# EasyEDA schematic SCH_Endstop_durable.json
TITLE: Sheet_1; REV: 1.0; Date: 2024-06-12; Sheet: 1/1; Drawn By: matias1; Company: Your Company
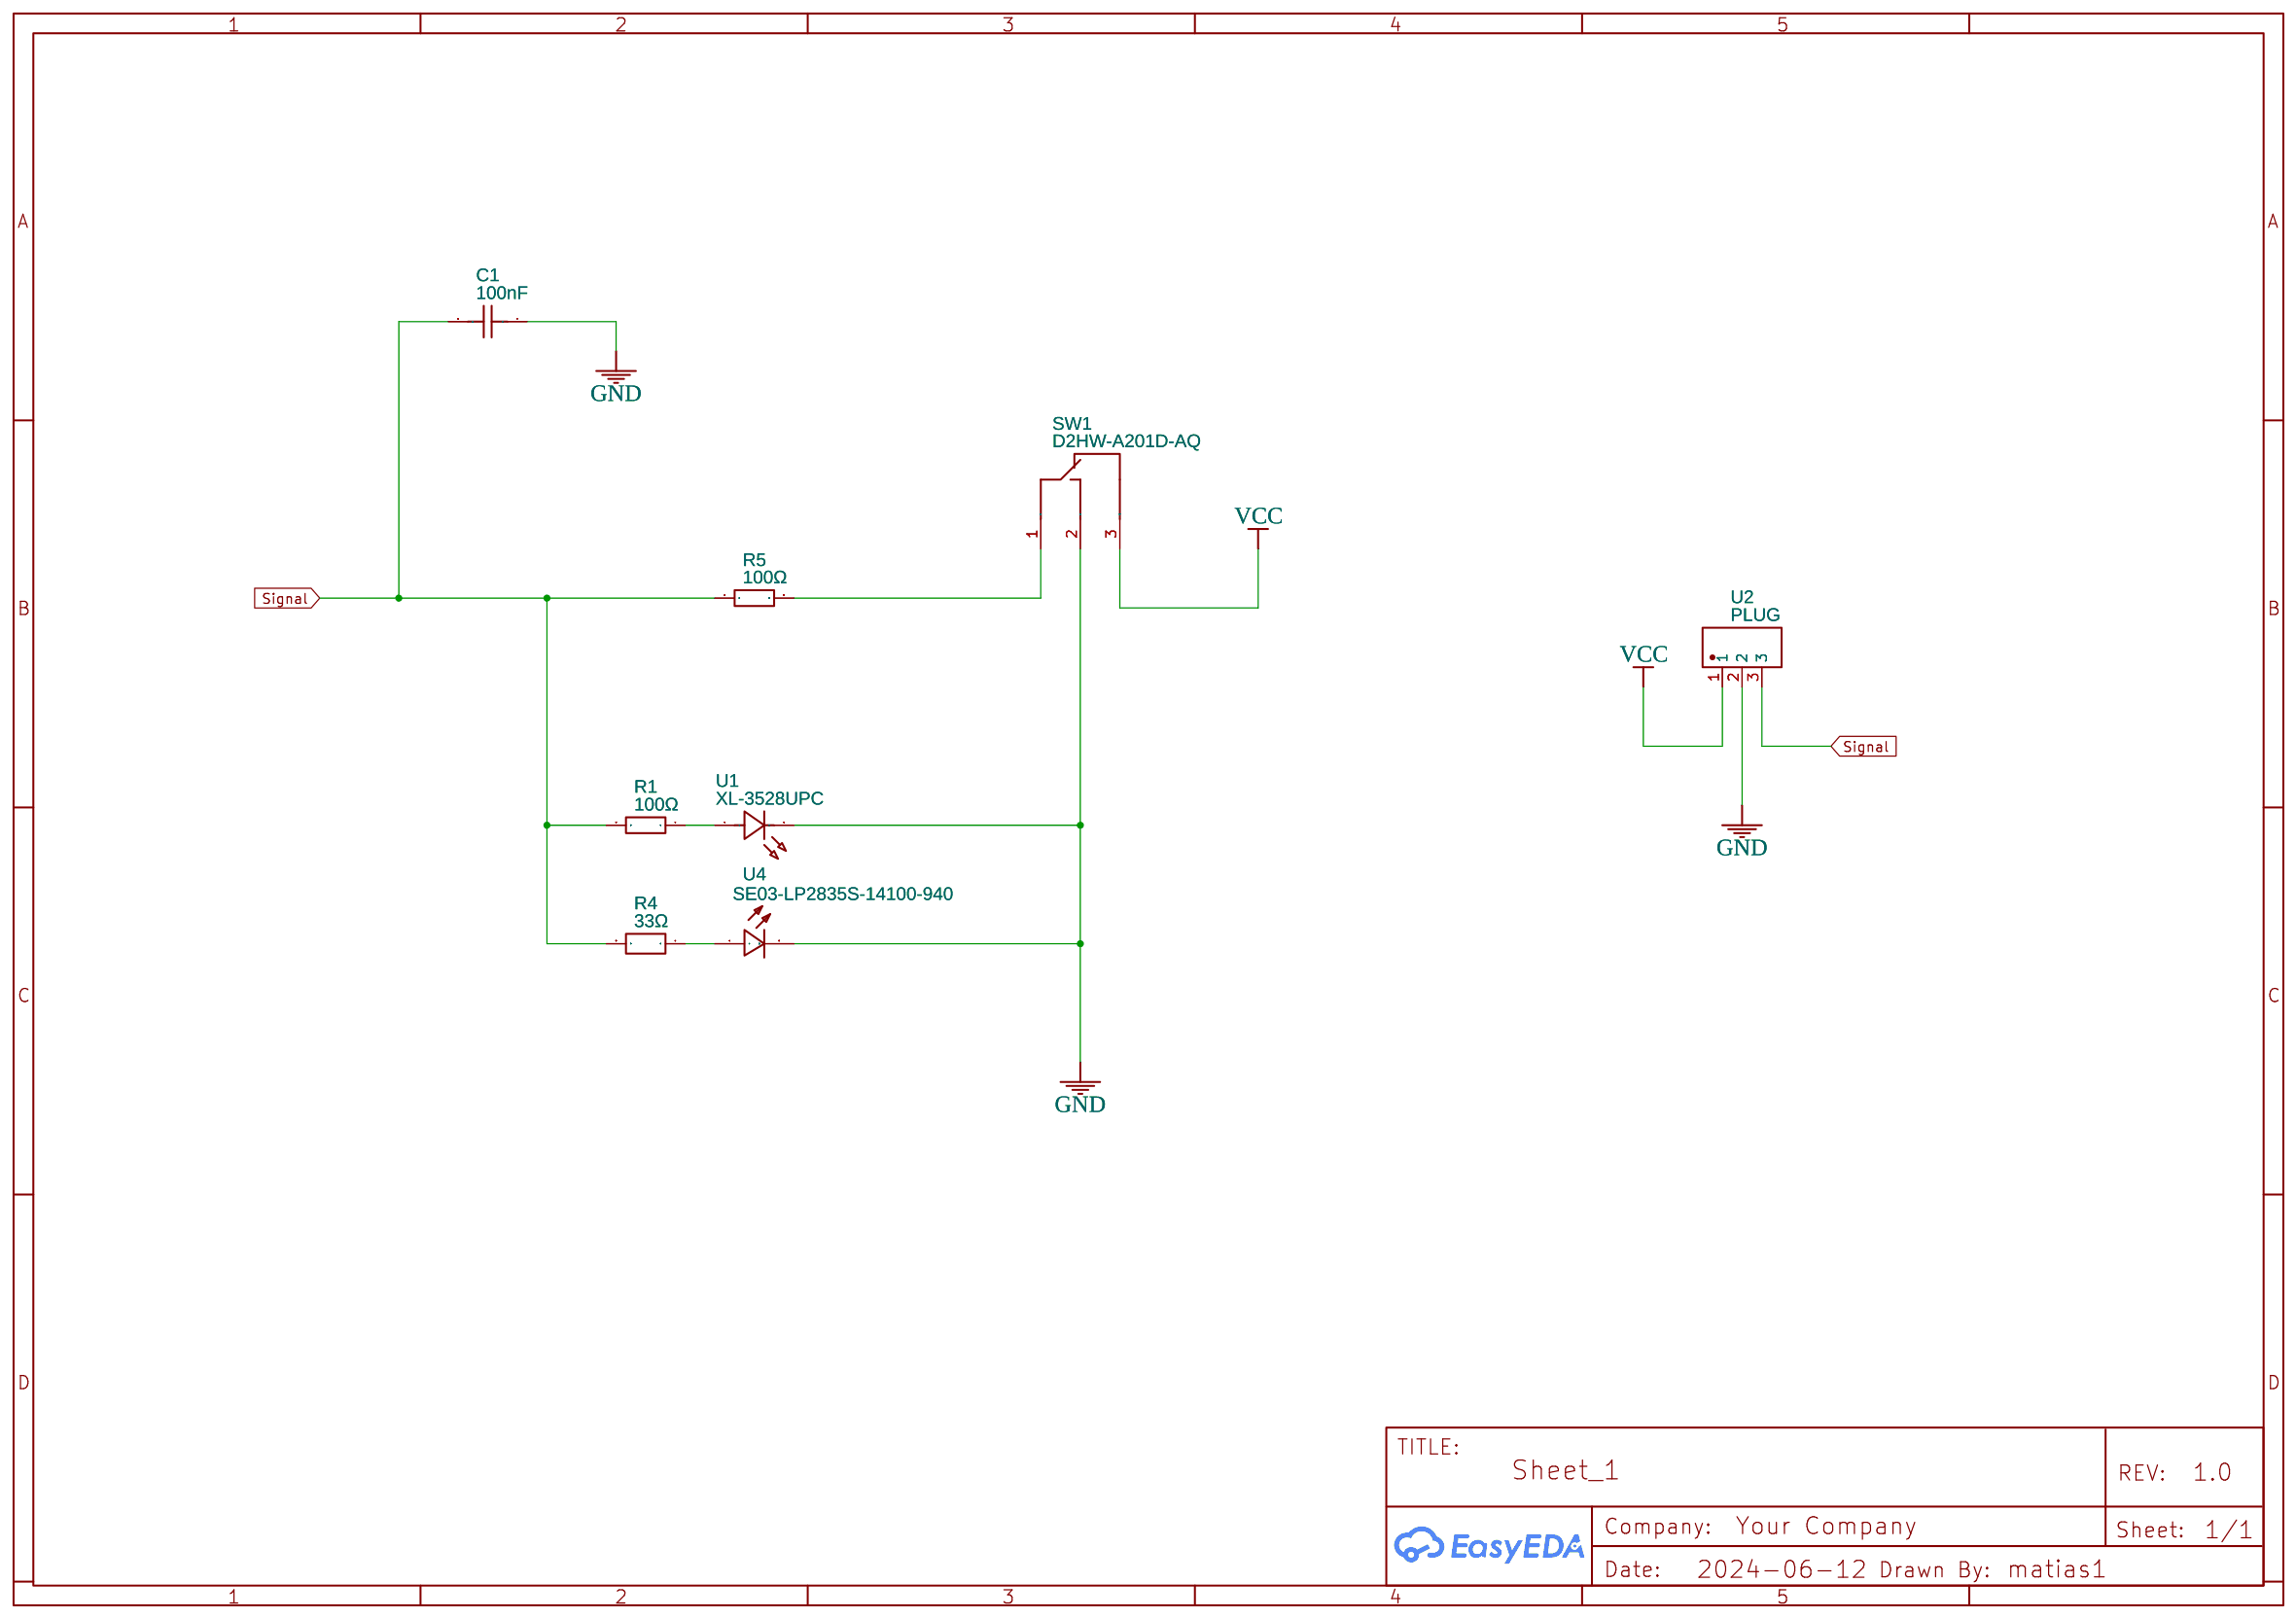
[diagram p0: schematic sheet]

## Parts
C1  100nF  [C0402]
R1  100Ω  [R0402]
R4  33Ω  [R0402]
R5  100Ω  [R0402]
SW1  D2HW-A201D-AQ  [SW-TH_D2HW-A201D-AQ]
U1  XL-3528UPC  [LED-SMD_L3.5-W2.7-R-RD]
U2  PLUG  [XH2.54-3P 90 DEGREE]
U4  SE03-LP2835S-14100-940  [SENSOR-SMD_L3.5-W2.8-FD]

## Library data of the parts
C1 = C1005X7R1C104KT000F: Contributor: LCSC; Supplier: LCSC; Supplier Part: C338032; Manufacturer: TDK; JLCPCB Part Class: Extended Part
R1 R5 = AR02BTC1000: Contributor: LCSC; Supplier: LCSC; Supplier Part: C317909; Manufacturer: Viking(光颉); JLCPCB Part Class: Extended Part
R4 = 0402 ±5% 33Ω: Contributor: lcsc; Supplier: LCSC; Supplier Part: C2889358; Manufacturer: VO(翔胜); JLCPCB Part Class: Extended Part
SW1 = D2HW-A201D-AQ: Supplier: LCSC; Supplier Part: C2911423; Manufacturer: OMRON(欧姆龙); JLCPCB Part Class: Extended Part; Contributor: lcsc
U1 = XL-3528UPC: Supplier: LCSC; Supplier Part: C2843806; Manufacturer: XINGLIGHT(成兴光); Contributor: lcsc; JLCPCB Part Class: Extended Part
U2 = WAFER-XH2.54-3PWZ: Contributor: lcsc; Supplier: LCSC; Supplier Part: C5374806; Manufacturer: XUNPU(讯普); JLCPCB Part Class: Extended Part
U4 = SE03-LP2835S-14100-940: Contributor: lcsc; Supplier: LCSC; Supplier Part: C5205247; Manufacturer: XSSY(旭晟); JLCPCB Part Class: Extended Part

## Nets
GND: C1.1 SW1.2 U1.2(K) U2.2 U4.2(C)
VCC: SW1.3 U2.1
Signal: C1.2 R1.2 R4.2 R5.1 U2.3
Net-(R1-1): R1.1 U1.1(A)
Net-(R4-1): R4.1 U4.1(A)
Net-(R5-2): R5.2 SW1.1
